# Altium schematic sheet tu lam bai 1.SchDoc
size A0; SheetNumber: 1; SheetTotal: 1
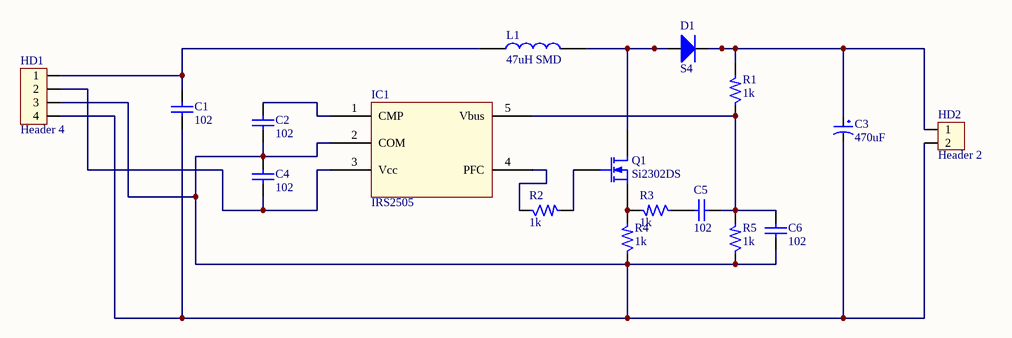
[diagram p0: tu lam bai 1.SchDoc]

## Parts
C1  102  [tu 0603]
C2  102  [tu 0603]
C3  470uF  [tu tantalum smd7343]
C4  102  [tu 0603]
C5  102  [tu 0603]
C6  102  [tu 0603]
D1  S4  [DIODE SOD-123]
HD1  Header 4  [HED4]
HD2  Header 2  [HED2]
IC1  IRS2505  [IRS2505]
L1  47uH SMD  [Cuon Cam 7x7x5]
Q1  Si2302DS  [SOT23]
R1  1k  [SM-RES-1206]
R2  1k  [SM-RES-1206]
R3  1k  [SM-RES-1206]
R4  1k  [SM-RES-1206]
R5  1k  [SM-RES-1206]

## Nets
NetC1_1: C1.1 HD1.1 L1.1
NetC1_2: C1.2 C2.2 C3.2 C4.1 C6.1 HD1.3 HD1.4 HD2.2 IC1.2(COM) R4.1 R5.1
NetC2_1: C2.1 IC1.1(CMP)
NetC3_1: C3.1 D1.2(K) HD2.1 R1.2
NetC4_2: C4.2 HD1.2 IC1.3(Vcc)
NetC5_1: C5.1 R3.1
NetC5_2: C5.2 C6.2 IC1.5(Vbus) R1.1 R5.2
NetD1_1: D1.1(A) L1.2 Q1.3(D)
NetIC1_4: IC1.4(PFC) R2.1
NetQ1_1: Q1.1(G) R2.2
NetQ1_2: Q1.2(S) R3.2 R4.2

## Library data of the parts
C1 C2 C4-C6 = Tu 0603 102 50V 10%: Dán; Don_Vi: Con; So_Chan: 2; Ten_Linh_Kien: Tụ 0603 102-1nF 10% 50V; Ma_Hang: MH004566; Chung_Loai: Dán; Kieu_Chan: *
C3 = Tu tantalum 470uF 10V SMD7343: Dán; Don_Vi: Con; So_Chan: 2; Ten_Linh_Kien: Tụ tantalum 477A-470uF 10V SMD7343; Ma_Hang: MH001956; Chung_Loai: Dán; Kieu_Chan: *
D1 = Diode S4: Dán; Ten_Linh_Kien: Diode S4 SOD123 ( 1N5819 SOD123); Ma_Hang: MH005519; Don_Vi: Con; Ghi_Chu: *; Chung_Loai: Dán; Kieu_Chan: *
HD1 = Hed4: Header 4 (Green); Value: Header 4
HD2 = Hed2: Header 2 (Green); Value: Header 2
L1 = CUON CAM 47uH SMD: Dán; Don_Vi: Con; Ma_Hang: MH004211; Ten_Linh_Kien: Cuộn Cảm 47uH 7x7x4MM CD74R; Ghi_Chu: *; Kieu_Chan: *; Chung_Loai: Dán
Q1 = Si2302DS: N-Channel MOSFET; Published: 8-Jun-2000; LatestRevisionDate: 17-Jul-2002; LatestRevisionNote: Re-released for DXP Platform.; PackageVersion: 1995/1996; PackageReference: E3; Publisher: Altium Limited; PackageDescription: TO, Flat Index; 3 In-Line, Axial Leads; Body Dia. 4.6mm; Lead Dia. 0.5 mm (max)
R1-R5 = R: Resistor 1/4W; Value: R1/4W - 1K